# EAGLE design Pixel8x4U (EAGLE 9.6.2)
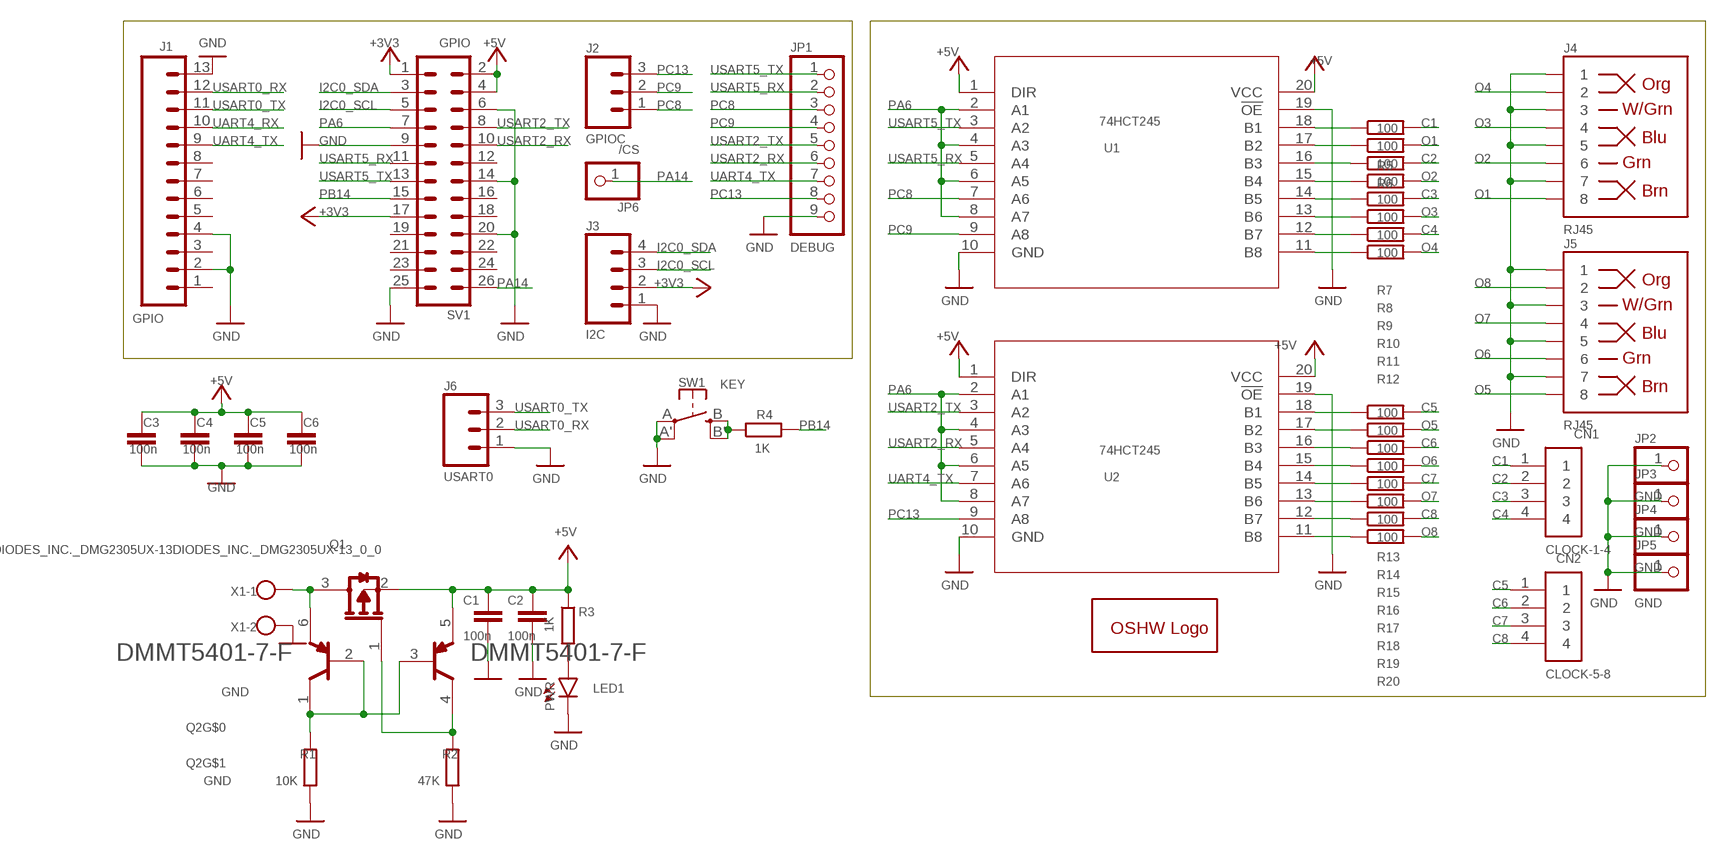
[diagram p0: schematic, sheet 1]

## Parts
C1  100n  C-EUC0603  [C0603]
C2  100n  C-EUC0603  [C0603]
C3  100n  C-EUC0603  [C0603]
C4  100n  C-EUC0603  [C0603]
C5  100n  C-EUC0603  [C0603]
C6  100n  C-EUC0603  [C0603]
CN1  CLOCK-1-4  1X4-CLEANBIG  [1X04-CLEANBIG]
CN2  CLOCK-5-8  1X4-CLEANBIG  [1X04-CLEANBIG]
GOLD_ORB_SM1  OSHWLOGOLOGO5MM  [OSHW_5MM]
J1  GPIO  CONN_13  [1X13]
J2  GPIOC  CONN_03  [1X03]
J3  I2C  CONN_04  [1X04]
J4  RJ45  RJ45-8  [RJ45-8]
J5  RJ45  RJ45-8  [RJ45-8]
J6  USART0  CONN_03  [1X03]
JP1  DEBUG  PINHD-1X9  [1X09]
JP2  GND  PINHD-1X1CB  [1X01-CLEANBIG]
JP3  GND  PINHD-1X1CB  [1X01-CLEANBIG]
JP4  GND  PINHD-1X1CB  [1X01-CLEANBIG]
JP5  GND  PINHD-1X1CB  [1X01-CLEANBIG]
JP6  /CS  PINHD-1X1CB  [1X01-CLEANBIG]
LED1  PWR  LEDCHIP-LED0603  [CHIP-LED0603]
Q1  DIODES_INC._DMG2305UX-13DIODES_INC._DMG2305UX-13_0_0  [DIODES_INC._DMG2305UX-13_0]
Q2  DMMT5401-7-F_0_0  DIODES_DMMT5401-7-FDIODES_DMMT5401-7-F_0_0  [DIODES_DMMT5401-7-F_0]
R1  10K  R-EU_R0402  [R0402]
R2  47K  R-EU_R0402  [R0402]
R3  1K  R-EU_R0402  [R0402]
R4  1K  R-EU_R0402  [R0402]
R5  100  R-EU_R0402  [R0402]
R6  100  R-EU_R0402  [R0402]
R7  100  R-EU_R0402  [R0402]
R8  100  R-EU_R0402  [R0402]
R9  100  R-EU_R0402  [R0402]
R10  100  R-EU_R0402  [R0402]
R11  100  R-EU_R0402  [R0402]
R12  100  R-EU_R0402  [R0402]
R13  100  R-EU_R0402  [R0402]
R14  100  R-EU_R0402  [R0402]
R15  100  R-EU_R0402  [R0402]
R16  100  R-EU_R0402  [R0402]
R17  100  R-EU_R0402  [R0402]
R18  100  R-EU_R0402  [R0402]
R19  100  R-EU_R0402  [R0402]
R20  100  R-EU_R0402  [R0402]
SV1  GPIO  MA13-2  [MA13-2]
SW1  KEY  SPST_TACT-EVQQ2  [EVQ-Q2]
U1  74HCT245  SN74HCT245PWR  [PW20]
U2  74HCT245  SN74HCT245PWR  [PW20]
X1  W237-102  [W237-102]

## Nets
+3V3: J3.2 SV1.1 SV1.17
+5V: C1.1 C2.1 C3.1 C4.1 C5.1 C6.1 Q1.2(S) Q2.5(E2) R3.1 SV1.2 SV1.4 U1.1(DIR) U1.20(VCC) U2.1(DIR) U2.20(VCC)
C1: CN1.1 R5.2
C2: CN1.2 R7.2
C3: CN1.3 R9.2
C4: CN1.4 R11.2
C5: CN2.1 R13.2
C6: CN2.2 R15.2
C7: CN2.3 R17.2
C8: CN2.4 R19.2
GND: C1.2 C2.2 C3.2 C4.2 C5.2 C6.2 J1.2 J1.4 J1.13 J3.1 J4.1 J4.3 J4.5 J4.7 J5.1 J5.3 J5.5 J5.7 J6.1 JP1.9 JP2.1 JP3.1 JP4.1 JP5.1 LED1.C R1.1 R2.1 SV1.6 SV1.9 SV1.14 SV1.20 SV1.25 SW1.A'(P1) SW1.A(P) U1.10(GND) U1.19(!OE) U2.10(GND) U2.19(!OE) X1.2
I2C0_SCL: J3.3 SV1.5
I2C0_SDA: J3.4 SV1.3
N$1: Q2.1(C1) Q2.2(B1) Q2.3(B2) R1.2
N$2: Q1.3(D) Q2.6(E1) X1.1
N$3: Q1.1(G) Q2.4(C2) R2.2
N$4: R4.1 SW1.B'(S1) SW1.B(S)
N$5: R6.1 U1.17(B2)
N$6: R12.1 U1.11(B8)
N$7: R10.1 U1.13(B6)
N$8: R8.1 U1.15(B4)
N$9: R5.1 U1.18(B1)
N$10: R7.1 U1.16(B3)
N$11: R14.1 U2.17(B2)
N$12: R16.1 U2.15(B4)
N$13: R18.1 U2.13(B6)
N$14: LED1.A R3.2
N$15: R20.1 U2.11(B8)
N$16: R9.1 U1.14(B5)
N$17: R11.1 U1.12(B7)
N$18: R13.1 U2.18(B1)
N$19: R15.1 U2.16(B3)
N$20: R17.1 U2.14(B5)
N$21: R19.1 U2.12(B7)
O1: J4.8 R6.2
O2: J4.6 R8.2
O3: J4.4 R10.2
O4: J4.2 R12.2
O5: J5.8 R14.2
O6: J5.6 R16.2
O7: J5.4 R18.2
O8: J5.2 R20.2
PA6: SV1.7 U1.2(A1) U1.4(A3) U1.6(A5) U1.8(A7) U2.2(A1) U2.4(A3) U2.6(A5) U2.8(A7)
PA14: JP6.1 SV1.26
PB14: R4.2 SV1.15
PC8: J2.1 JP1.3 U1.7(A6)
PC9: J2.2 JP1.4 U1.9(A8)
PC13: J2.3 JP1.8 U2.9(A8)
UART4_RX: J1.10
UART4_TX: J1.9 JP1.7 U2.7(A6)
USART0_RX: J1.12 J6.2
USART0_TX: J1.11 J6.3
USART2_RX: JP1.6 SV1.10 U2.5(A4)
USART2_TX: JP1.5 SV1.8 U2.3(A2)
USART5_RX: JP1.2 SV1.11 U1.5(A4)
USART5_TX: JP1.1 SV1.13 U1.3(A2)
Unconnected: J1.1 J1.3 J1.5 J1.6 J1.7 J1.8 SV1.12 SV1.16 SV1.18 SV1.19 SV1.21 SV1.22 SV1.23 SV1.24

## Library data of the parts
C1-C6 = rcl:C-EU: CAPACITOR, European symbol; SPICEPREFIX: C
CN1 CN2 = adafruit:1X4: 4-pin connector
GOLD_ORB_SM1 = oshw:OSHWLOGO: The OSHW logo for PCB layout
J1 = SparkFun-Connectors:CONN_13: Multi connection point. Often used as Generic Header-pin footprint for 0.1 inch spaced/style header connections On any of the 0.1 inch spaced packages, you can populate with these: Break Away Headers - Straight <https://www.sparkfun.com/products/116> (PRT-00116) Break Away Male Headers - Right Angle <https://www.sparkfun.com/products/553> (PRT-00553) Female Headers <https://www.sparkfun.com/products/115> (PRT-00115) Break Away Headers - Machine Pin <https://www.sparkfun.com/products/117> (PRT-00117) Break Away Female Headers - Swiss Machine Pin <https://www.sparkfun.com/products/743> (PRT-00743) For SCREWTERMINALS and SPRING TERMINALS visit here: Screw Terimnals on SparkFun.com <https://www.sparkfun.com/search/results?term=Screw+Terminals> (5mm/3.5mm/2.54mm spacing) This device is also useful as a general connection point to wire up your design to another part of your project. Our various solder wires solder well into these plated through hole pads. Hook-Up Wire - Assortment (Stranded, 22 AWG) <https://www.sparkfun.com/products/11375> (PRT-11375) Hook-Up Wire - Assortment (Solid Core, 22 AWG) <https://www.sparkfun.com/products/11367> (PRT-11367) View the entire wire category on our website here <https://www.sparkfun.com/categories/141> Special notes: Molex polarized connector foot print use with SKU : PRT-08231 with associated crimp pins and housings. 1MM SMD Version SKU: PRT-10208 NOTES ON THE VARIANTS LOCK and LOCK_LONGPADS... This footprint was designed to help hold the alignment of a through-hole component (i.e. 6-pin header) while soldering it into place. You may notice that each hole has been shifted either up or down by 0.005 of an inch from it's more standard position (which is a perfectly straight line). This slight alteration caused the pins (the squares in the middle) to touch the edges of the holes. Because they are alternating, it causes a "brace" to hold the component in place. 0.005 has proven to be the perfect amount of "off-center" position when using our standard breakaway headers. Although looks a little odd when you look at the bare footprint, once you have a header in there, the alteration is very hard to notice. Also,if you push a header all the way into place, it is covered up entirely on the bottom side.
J2 J6 = SparkFun-Connectors:CONN_03: Multi connection point. Often used as Generic Header-pin footprint for 0.1 inch spaced/style header connections On any of the 0.1 inch spaced packages, you can populate with these: Break Away Headers - Straight <https://www.sparkfun.com/products/116> (PRT-00116) Break Away Male Headers - Right Angle <https://www.sparkfun.com/products/553> (PRT-00553) Female Headers <https://www.sparkfun.com/products/115> (PRT-00115) Break Away Headers - Machine Pin <https://www.sparkfun.com/products/117> (PRT-00117) Break Away Female Headers - Swiss Machine Pin <https://www.sparkfun.com/products/743> (PRT-00743) Stackable Header - 3 Pin (Female, 0.1") <https://www.sparkfun.com/products/13875> (PRT-13875) For SCREWTERMINALS and SPRING TERMINALS visit here: Screw Terimnals on SparkFun.com <https://www.sparkfun.com/search/results?term=Screw+Terminals> (5mm/3.5mm/2.54mm spacing) This device is also useful as a general connection point to wire up your design to another part of your project. Our various solder wires solder well into these plated through hole pads. Hook-Up Wire - Assortment (Stranded, 22 AWG) <https://www.sparkfun.com/products/11375> (PRT-11375) Hook-Up Wire - Assortment (Solid Core, 22 AWG) <https://www.sparkfun.com/products/11367> (PRT-11367) View the entire wire category on our website here <https://www.sparkfun.com/categories/141> Special notes: Molex polarized connector foot print use with SKU : PRT-08232 with associated crimp pins and housings.
J3 = SparkFun-Connectors:CONN_04: Multi connection point. Often used as Generic Header-pin footprint for 0.1 inch spaced/style header connections On any of the 0.1 inch spaced packages, you can populate with these: Break Away Headers - Straight <https://www.sparkfun.com/products/116> (PRT-00116) Break Away Male Headers - Right Angle <https://www.sparkfun.com/products/553> (PRT-00553) Female Headers <https://www.sparkfun.com/products/115> (PRT-00115) Break Away Headers - Machine Pin <https://www.sparkfun.com/products/117> (PRT-00117) Break Away Female Headers - Swiss Machine Pin <https://www.sparkfun.com/products/743> (PRT-00743) For SCREWTERMINALS and SPRING TERMINALS visit here: Screw Terimnals on SparkFun.com <https://www.sparkfun.com/search/results?term=Screw+Terminals> (5mm/3.5mm/2.54mm spacing) This device is also useful as a general connection point to wire up your design to another part of your project. Our various solder wires solder well into these plated through hole pads. Hook-Up Wire - Assortment (Stranded, 22 AWG) <https://www.sparkfun.com/products/11375> (PRT-11375) Hook-Up Wire - Assortment (Solid Core, 22 AWG) <https://www.sparkfun.com/products/11367> (PRT-11367) View the entire wire category on our website here <https://www.sparkfun.com/categories/141> Special notes: Molex polarized connector foot print use with SKU : PRT-08231 with associated crimp pins and housings. 1MM SMD Version SKU: PRT-10208; PROD_ID: CONN-09696
J4 J5 = SparkFun-Connectors:RJ45-8: RJ45 Jack - 8 pin Simple RJ45, 8-pin connection. Commonly used for Cat5, Cat5e, and Cat6 Ethernet cables. Here is the connector we sell at SparkFun: RJ45 8-Pin Connector <https://www.sparkfun.com/products/643> (PRT-00643) Datasheet <https://cdn.sparkfun.com/datasheets/Prototyping/04908.pdf> It is used on this SparkFun product: SparkFun RJ45 Breakout <https://www.sparkfun.com/products/716> (BOB-00716) Note, you may also be interested in the "MAGJACK" version of this. It is basically a RJ45 connector, but also has some status LEDs built into the connector housing. You can check that out in this library at the device named "MAGJACK.dev" and see these products online: RJ45 Ethernet MagJack-Compatible <https://www.sparkfun.com/products/8534> (PRT-08534) SparkFun RJ45 MagJack Breakout <https://www.sparkfun.com/products/13021> (BOB-13021); PROD_ID: CONN-08506; SF_ID: PRT-00643
JP1 = pinhead:PINHD-1X9: PIN HEADER
JP2-JP6 = adafruit:PINHD-1X1: Pin header 1x1 for 0.1" spacing With round pins
LED1 = led:LED: LED OSRAM: - CHIPLED LG R971, LG N971, LY N971, LG Q971, LY Q971, LO R971, LY R971 LH N974, LH R974 LS Q976, LO Q976, LY Q976 LO Q996 - Hyper CHIPLED LW Q18S LB Q993, LB Q99A, LB R99A - SideLED LS A670, LO A670, LY A670, LG A670, LP A670 LB A673, LV A673, LT A673, LW A673 LH A674 LY A675 LS A676, LA A676, LO A676, LY A676, LW A676 LS A679, LY A679, LG A679 - Hyper Micro SIDELED® LS Y876, LA Y876, LO Y876, LY Y876 LT Y87S - SmartLED LW L88C, LW L88S LB L89C, LB L89S, LG L890 LS L89K, LO L89K, LY L89K LS L896, LA L896, LO L896, LY L896 - TOPLED LS T670, LO T670, LY T670, LG T670, LP T670 LSG T670, LSP T670, LSY T670, LOP T670, LYG T670 LG T671, LOG T671, LSG T671 LB T673, LV T673, LT T673, LW T673 LH T674 LS T676, LA T676, LO T676, LY T676, LB T676, LH T676, LSB T676, LW T676 LB T67C, LV T67C, LT T67C, LS T67K, LO T67K, LY T67K, LW E67C LS E67B, LA E67B, LO E67B, LY E67B, LB E67C, LV E67C, LT E67C LW T67C LS T679, LY T679, LG T679 LS T770, LO T770, LY T770, LG T770, LP T770 LB T773, LV T773, LT T773, LW T773 LH T774 LS E675, LA E675, LY E675, LS T675 LS T776, LA T776, LO T776, LY T776, LB T776 LHGB T686 LT T68C, LB T68C - Hyper Mini TOPLED® LB M676 - Mini TOPLED Santana® LG M470 LS M47K, LO M47K, LY M47K Source: http://www.osram.convergy.de LUXEON: - LUMILED® LXK2-PW12-R00, LXK2-PW12-S00, LXK2-PW14-U00, LXK2-PW14-V00 LXK2-PM12-R00, LXK2-PM12-S00, LXK2-PM14-U00 LXK2-PE12-Q00, LXK2-PE12-R00, LXK2-PE12-S00, LXK2-PE14-T00, LXK2-PE14-U00 LXK2-PB12-K00, LXK2-PB12-L00, LXK2-PB12-M00, LXK2-PB14-N00, LXK2-PB14-P00, LXK2-PB14-Q00 LXK2-PR12-L00, LXK2-PR12-M00, LXK2-PR14-Q00, LXK2-PR14-R00 LXK2-PD12-Q00, LXK2-PD12-R00, LXK2-PD12-S00 LXK2-PH12-R00, LXK2-PH12-S00 LXK2-PL12-P00, LXK2-PL12-Q00, LXK2-PL12-R00 Source: www.luxeon.com KINGBRIGHT: KA-3528ASYC Source: www.kingbright.com
Q1 = Diodes Inc. - DMG2305UX-13:DIODES_INC._DMG2305UX-13: P-Channel 20V 4.2A (Ta) 1.4W (Ta) Surface Mount SOT-23; AUTOMOTIVE: No; CENTROID_NOT_SPECIFIED: No; CONTINUOUS_DRAIN_CURRENT: -4.2A; DATASHEET: https://www.diodes.com/assets/Datasheets/DMG2305UX.pdf; DEPLETION_MODE: False; DEVICE_CLASS_L1: Discrete Semiconductors; DEVICE_CLASS_L2: Transistors; DEVICE_CLASS_L3: MOSFETs; DIGIKEY_DESCRIPTION: TRANS MOSFET P-CH 20V 4.2A SOT23; DIGIKEY_PART_NUMBER: DMG2305UX-13DICT-ND; DRAIN_TO_SOURCE_BREAKDOWN_VOLTAGE: -20V; DRAIN_TO_SOURCE_RESISTANCE: 40mΩ; DRAIN_TO_SOURCE_VOLTAGE: -20V; FOOTPRINT_PARAMETERS_1: {"fp_type":"SOT23","params":{"N":{"default":"3","long name":"Number of leads","type":"multichoice","short name":"N"},"A":{"nom":1024999,"long name":"Height","min":903000,"max":1100000,"short name":"A","type":"measurement"},"A1":{"nom":50000,"long name":"Package clearance","min":13000,"max":100000,"short name":"A1","type":"measurement"},"A2":{"nom":975000,"long name":"Package height","min":890000,"max":1000000,"short name":"A2","type":"measurement"},"D":{"nom":2900000,"long name":"Package length","min":2800000,"max":3000000,"short name":"D","type":"measurement"},"E":{"nom":2400000,"long name":"Width /w leads","min":2300000,"max":2500000,"short name":"E","type":"measurement"},"E1":{"nom":1300000,"long name":"Package width","min":1200000,"max":1400000,"short name":"E1","type":"measurement"},"B":{"nom":400000,"long name":"Lead width","min":370000,"max":510000,"short name":"B","type":"measurement"},"C":{"nom":110000,"long name":"Lead thickness","min":85000,"max":150000,"short name":"C","type":"measurement"},"L":{"nom":400000,"long name":"Lead foot length","min":250000,"max":550000,"short name":"L","type":"measurement"},"e":{"nom":915000,"long name":"Lead pitch","min":null,"max":null,"short name":"e","type":"measurement"},"PHI":{"nom":false,"long name":"Lead angle","min":0,"max":8000000,"short name":"PHI","type":"measurement"},"offset x":{"nom":0,"long name":"X Center offset","min":null,"max":null,"short name":"offset x","type":"measurement"},"offset y":{"nom":0,"long name":"Y Center offset","min":null,"max":null,"short name":"offset y","type":"measurement"},"LS":{"default":"Rounded rectangle","long name":"Land shape","type":"multichoice","short name":"LS"},"LS1":{"default":"Rectangle","long name":"Land shape (Pin 1)","type":"multichoice","short name":"LS1"},"solder toe":{"nom":550000,"long name":"Solder fillet (toe)","min":null,"max":null,"short name":"solder toe","type":"fixedmeasurement"},"solder heel":{"nom":450000,"long name":"Solder fillet (heel)","min":null,"max":null,"short name":"solder heel","type":"fixedmeasurement"},"solder side":{"nom":50000,"long name":"Solder fillet (side)","min":null,"max":null,"short name":"solder side","type":"fixedmeasurement"},"courtyard":{"nom":500000,"long name":"Courtyard","min":null,"max":null,"short name":"courtyard","type":"fixedmeasurement"},"SF":{"default":"A","long name":"Packing level","type":"multichoiceparent","short name":"SF","help":"http://support.upverter.com/customer/portal/articles/978783-what-is-a-footprint-packing-level","children":["solder toe","solder heel","solder side","courtyard"]}}}; FOOTPRINT_PARAMETERS_2: {"fp_type":"SOT23","params":{"N":{"default":"3","long name":"Number of leads","type":"multichoice","short name":"N"},"A":{"nom":1024999,"long name":"Height","min":903000,"max":1100000,"short name":"A","type":"measurement"},"A1":{"nom":50000,"long name":"Package clearance","min":13000,"max":100000,"short name":"A1","type":"measurement"},"A2":{"nom":975000,"long name":"Package height","min":890000,"max":1000000,"short name":"A2","type":"measurement"},"D":{"nom":2900000,"long name":"Package length","min":2800000,"max":3000000,"short name":"D","type":"measurement"},"E":{"nom":2400000,"long name":"Width /w leads","min":2300000,"max":2500000,"short name":"E","type":"measurement"},"E1":{"nom":1300000,"long name":"Package width","min":1200000,"max":1400000,"short name":"E1","type":"measurement"},"B":{"nom":400000,"long name":"Lead width","min":370000,"max":510000,"short name":"B","type":"measurement"},"C":{"nom":110000,"long name":"Lead thickness","min":85000,"max":150000,"short name":"C","type":"measurement"},"L":{"nom":400000,"long name":"Lead foot length","min":250000,"max":550000,"short name":"L","type":"measurement"},"e":{"nom":915000,"long name":"Lead pitch","min":null,"max":null,"short name":"e","type":"measurement"},"PHI":{"nom":false,"long name":"Lead angle","min":0,"max":8000000,"short name":"PHI","type":"measurement"},"offset x":{"nom":0,"long name":"X Center offset","min":null,"max":null,"short name":"offset x","type":"measurement"},"offset y":{"nom":0,"long name":"Y Center offset","min":null,"max":null,"short name":"offset y","type":"measurement"},"LS":{"default":"Rounded rectangle","long name":"Land shape","type":"multichoice","short name":"LS"},"LS1":{"default":"Rectangle","long name":"Land shape (Pin 1)","type":"multichoice","short name":"LS1"},"solder toe":{"nom":350000,"long name":"Solder fillet (toe)","min":null,"max":null,"short name":"solder toe","type":"fixedmeasurement"},"solder heel":{"nom":350000,"long name":"Solder fillet (heel)","min":null,"max":null,"short name":"solder heel","type":"fixedmeasurement"},"solder side":{"nom":30000,"long name":"Solder fillet (side)","min":null,"max":null,"short name":"solder side","type":"fixedmeasurement"},"courtyard":{"nom":250000,"long name":"Courtyard","min":null,"max":null,"short name":"courtyard","type":"fixedmeasurement"},"SF":{"default":"B","long name":"Packing level","type":"multichoiceparent","short name":"SF","help":"http://support.upverter.com/customer/portal/articles/978783-what-is-a-footprint-packing-level","children":["solder toe","solder heel","solder side","courtyard"]}}}; FOOTPRINT_PARAMETERS_3: {"fp_type":"SOT23","params":{"N":{"default":"3","long name":"Number of leads","type":"multichoice","short name":"N"},"A":{"nom":1024999,"long name":"Height","min":903000,"max":1100000,"short name":"A","type":"measurement"},"A1":{"nom":50000,"long name":"Package clearance","min":13000,"max":100000,"short name":"A1","type":"measurement"},"A2":{"nom":975000,"long name":"Package height","min":890000,"max":1000000,"short name":"A2","type":"measurement"},"D":{"nom":2900000,"long name":"Package length","min":2800000,"max":3000000,"short name":"D","type":"measurement"},"E":{"nom":2400000,"long name":"Width /w leads","min":2300000,"max":2500000,"short name":"E","type":"measurement"},"E1":{"nom":1300000,"long name":"Package width","min":1200000,"max":1400000,"short name":"E1","type":"measurement"},"B":{"nom":400000,"long name":"Lead width","min":370000,"max":510000,"short name":"B","type":"measurement"},"C":{"nom":110000,"long name":"Lead thickness","min":85000,"max":150000,"short name":"C","type":"measurement"},"L":{"nom":400000,"long name":"Lead foot length","min":250000,"max":550000,"short name":"L","type":"measurement"},"e":{"nom":915000,"long name":"Lead pitch","min":null,"max":null,"short name":"e","type":"measurement"},"PHI":{"nom":false,"long name":"Lead angle","min":0,"max":8000000,"short name":"PHI","type":"measurement"},"offset x":{"nom":0,"long name":"X Center offset","min":null,"max":null,"short name":"offset x","type":"measurement"},"offset y":{"nom":0,"long name":"Y Center offset","min":null,"max":null,"short name":"offset y","type":"measurement"},"LS":{"default":"Rounded rectangle","long name":"Land shape","type":"multichoice","short name":"LS"},"LS1":{"default":"Rectangle","long name":"Land shape (Pin 1)","type":"multichoice","short name":"LS1"},"solder toe":{"nom":150000,"long name":"Solder fillet (toe)","min":null,"max":null,"short name":"solder toe","type":"fixedmeasurement"},"solder heel":{"nom":250000,"long name":"Solder fillet (heel)","min":null,"max":null,"short name":"solder heel","type":"fixedmeasurement"},"solder side":{"nom":10000,"long name":"Solder fillet (side)","min":null,"max":null,"short name":"solder side","type":"fixedmeasurement"},"courtyard":{"nom":100000,"long name":"Courtyard","min":null,"max":null,"short name":"courtyard","type":"fixedmeasurement"},"SF":{"default":"C","long name":"Packing level","type":"multichoiceparent","short name":"SF","help":"http://support.upverter.com/customer/portal/articles/978783-what-is-a-footprint-packing-level","children":["solder toe","solder heel","solder side","courtyard"]}}}; FOOTPRINT_URL: https://www.diodes.com/assets/Package-Files/SOT23.pdf; FOOTPRINT_VARIANT_NAME_0: Recommended_Land_Pattern; FOOTPRINT_VARIANT_NAME_1: IPC_A; FOOTPRINT_VARIANT_NAME_2: IPC_B; FOOTPRINT_VARIANT_NAME_3: IPC_C; GATE_CHARGE_AT_VGS: 10.2nC @ -4.5V; GATE_TO_SOURCE_VOLTAGE: 8V; HEIGHT: 1.1mm; INPUT_CAPACITACE_AT_VDS: 808pF @ -15V; IPC_LAND_PATTERN_NAME: SOT92P240X102-3; LEAD_FREE: Yes; MAX_JUNCTION_TEMP: +150°C; MF: Diodes Inc.; MFG_PACKAGE_IDENT: SOT23; MFG_PACKAGE_IDENT_DATE: 01/2017; MFG_PACKAGE_IDENT_REV: 0; MOUSER_DESCRIPTION: MOSFET P-Ch ENH FET -20V 52mOhm -5.0V; MOUSER_PART_NUMBER: 621-DMG2305UX-13; MPN: DMG2305UX-13; NUMBER_OF_CHANNELS: 1; NUMBER_OF_P_CHANNELS: 1; PACKAGE: SOT23; POWER_DISSIPATION: 1.4W; PREFIX: Q; PULSE_DRAIN_CURRENT: -15A; ROHS: Yes; RTHJA_MAX: 90°C/W; STANDOFF_HEIGHT: 0.013mm; TEMPERATURE_RANGE_HIGH: +150°C; TEMPERATURE_RANGE_LOW: -55°C; THRESHOLD_VGS_MAX: -0.9V; THRESHOLD_VGS_MIN: -0.5V; TURN_OFF_DELAY_TIME: 79.3ns; TURN_ON_DELAY_TIME: 10.8ns; VERIFICATION_VERSION: 0.0.0.3
Q2 = Diodes - DMMT5401-7-F:DIODES_DMMT5401-7-F: Bipolar (BJT) Transistor Array 2 PNP (Dual) Matched Pair 150V 200mA 300MHz 300mW Surface Mount SOT-26; AUTOMOTIVE: Yes; AUTOMOTIVE_GRADE: Grade 0; CENTROID_NOT_SPECIFIED: No; CIIVA_IDS: 854262; COLLECTOR_BASE_VOLTAGE: -160V; COLLECTOR_EMITTER_BREAKDOWN_VOLTAGE: -150V; COLLECTOR_EMITTER_SATURATION_VOLTAGE: -0.5V; COLLECTOR_EMITTER_VOLTAGE: -150V; DATASHEET: https://www.diodes.com/assets/Datasheets/ds30437.pdf; DEVICE_CLASS_L1: Discrete Semiconductors; DEVICE_CLASS_L2: Transistors; DEVICE_CLASS_L3: BJTs; DIGIKEY_DESCRIPTION: TRANS 2PNP 150V 0.2A SOT26; DIGIKEY_PART_NUMBER: DMMT5401-FDICT-ND; EMITTER_BASE_VOLTAGE: -5V; FOOTPRINT_PARAMETERS_1: {"fp_type":"SOT23","params":{"N":{"default":"6","long name":"Number of leads","type":"multichoice","short name":"N"},"A":{"nom":1150000,"long name":"Height","min":1012999,"max":1400000,"short name":"A","type":"measurement"},"A1":{"nom":50000,"long name":"Package clearance","min":13000,"max":100000,"short name":"A1","type":"measurement"},"A2":{"nom":1100000,"long name":"Package height","min":1000000,"max":1300000,"short name":"A2","type":"measurement"},"D":{"nom":3000000,"long name":"Package length","min":2900000,"max":3100000,"short name":"D","type":"measurement"},"E":{"nom":2800000,"long name":"Width /w leads","min":2700000,"max":3000000,"short name":"E","type":"measurement"},"E1":{"nom":1600000,"long name":"Package width","min":1500000,"max":1700000,"short name":"E1","type":"measurement"},"B":{"nom":380000,"long name":"Lead width","min":350000,"max":500000,"short name":"B","type":"measurement"},"C":{"nom":150000,"long name":"Lead thickness","min":100000,"max":200000,"short name":"C","type":"measurement"},"L":{"nom":400000,"long name":"Lead foot length","min":350000,"max":550000,"short name":"L","type":"measurement"},"e":{"nom":950000,"long name":"Lead pitch","min":null,"max":null,"short name":"e","type":"measurement"},"PHI":{"nom":false,"long name":"Lead angle","min":0,"max":8000000,"short name":"PHI","type":"measurement"},"offset x":{"nom":0,"long name":"X Center offset","min":null,"max":null,"short name":"offset x","type":"measurement"},"offset y":{"nom":0,"long name":"Y Center offset","min":null,"max":null,"short name":"offset y","type":"measurement"},"LS":{"default":"Rounded rectangle","long name":"Land shape","type":"multichoice","short name":"LS"},"LS1":{"default":"Rectangle","long name":"Land shape (Pin 1)","type":"multichoice","short name":"LS1"},"solder toe":{"nom":550000,"long name":"Solder fillet (toe)","min":null,"max":null,"short name":"solder toe","type":"fixedmeasurement"},"solder heel":{"nom":450000,"long name":"Solder fillet (heel)","min":null,"max":null,"short name":"solder heel","type":"fixedmeasurement"},"solder side":{"nom":50000,"long name":"Solder fillet (side)","min":null,"max":null,"short name":"solder side","type":"fixedmeasurement"},"courtyard":{"nom":500000,"long name":"Courtyard","min":null,"max":null,"short name":"courtyard","type":"fixedmeasurement"},"SF":{"default":"A","long name":"Packing level","type":"multichoiceparent","short name":"SF","help":"http://support.upverter.com/customer/portal/articles/978783-what-is-a-footprint-packing-level","children":["solder toe","solder heel","solder side","courtyard"]}}}; FOOTPRINT_PARAMETERS_2: {"fp_type":"SOT23","params":{"N":{"default":"6","long name":"Number of leads","type":"multichoice","short name":"N"},"A":{"nom":1150000,"long name":"Height","min":1012999,"max":1400000,"short name":"A","type":"measurement"},"A1":{"nom":50000,"long name":"Package clearance","min":13000,"max":100000,"short name":"A1","type":"measurement"},"A2":{"nom":1100000,"long name":"Package height","min":1000000,"max":1300000,"short name":"A2","type":"measurement"},"D":{"nom":3000000,"long name":"Package length","min":2900000,"max":3100000,"short name":"D","type":"measurement"},"E":{"nom":2800000,"long name":"Width /w leads","min":2700000,"max":3000000,"short name":"E","type":"measurement"},"E1":{"nom":1600000,"long name":"Package width","min":1500000,"max":1700000,"short name":"E1","type":"measurement"},"B":{"nom":380000,"long name":"Lead width","min":350000,"max":500000,"short name":"B","type":"measurement"},"C":{"nom":150000,"long name":"Lead thickness","min":100000,"max":200000,"short name":"C","type":"measurement"},"L":{"nom":400000,"long name":"Lead foot length","min":350000,"max":550000,"short name":"L","type":"measurement"},"e":{"nom":950000,"long name":"Lead pitch","min":null,"max":null,"short name":"e","type":"measurement"},"PHI":{"nom":false,"long name":"Lead angle","min":0,"max":8000000,"short name":"PHI","type":"measurement"},"offset x":{"nom":0,"long name":"X Center offset","min":null,"max":null,"short name":"offset x","type":"measurement"},"offset y":{"nom":0,"long name":"Y Center offset","min":null,"max":null,"short name":"offset y","type":"measurement"},"LS":{"default":"Rounded rectangle","long name":"Land shape","type":"multichoice","short name":"LS"},"LS1":{"default":"Rectangle","long name":"Land shape (Pin 1)","type":"multichoice","short name":"LS1"},"solder toe":{"nom":350000,"long name":"Solder fillet (toe)","min":null,"max":null,"short name":"solder toe","type":"fixedmeasurement"},"solder heel":{"nom":350000,"long name":"Solder fillet (heel)","min":null,"max":null,"short name":"solder heel","type":"fixedmeasurement"},"solder side":{"nom":30000,"long name":"Solder fillet (side)","min":null,"max":null,"short name":"solder side","type":"fixedmeasurement"},"courtyard":{"nom":250000,"long name":"Courtyard","min":null,"max":null,"short name":"courtyard","type":"fixedmeasurement"},"SF":{"default":"B","long name":"Packing level","type":"multichoiceparent","short name":"SF","help":"http://support.upverter.com/customer/portal/articles/978783-what-is-a-footprint-packing-level","children":["solder toe","solder heel","solder side","courtyard"]}}}; FOOTPRINT_PARAMETERS_3: {"fp_type":"SOT23","params":{"N":{"default":"6","long name":"Number of leads","type":"multichoice","short name":"N"},"A":{"nom":1150000,"long name":"Height","min":1012999,"max":1400000,"short name":"A","type":"measurement"},"A1":{"nom":50000,"long name":"Package clearance","min":13000,"max":100000,"short name":"A1","type":"measurement"},"A2":{"nom":1100000,"long name":"Package height","min":1000000,"max":1300000,"short name":"A2","type":"measurement"},"D":{"nom":3000000,"long name":"Package length","min":2900000,"max":3100000,"short name":"D","type":"measurement"},"E":{"nom":2800000,"long name":"Width /w leads","min":2700000,"max":3000000,"short name":"E","type":"measurement"},"E1":{"nom":1600000,"long name":"Package width","min":1500000,"max":1700000,"short name":"E1","type":"measurement"},"B":{"nom":380000,"long name":"Lead width","min":350000,"max":500000,"short name":"B","type":"measurement"},"C":{"nom":150000,"long name":"Lead thickness","min":100000,"max":200000,"short name":"C","type":"measurement"},"L":{"nom":400000,"long name":"Lead foot length","min":350000,"max":550000,"short name":"L","type":"measurement"},"e":{"nom":950000,"long name":"Lead pitch","min":null,"max":null,"short name":"e","type":"measurement"},"PHI":{"nom":false,"long name":"Lead angle","min":0,"max":8000000,"short name":"PHI","type":"measurement"},"offset x":{"nom":0,"long name":"X Center offset","min":null,"max":null,"short name":"offset x","type":"measurement"},"offset y":{"nom":0,"long name":"Y Center offset","min":null,"max":null,"short name":"offset y","type":"measurement"},"LS":{"default":"Rounded rectangle","long name":"Land shape","type":"multichoice","short name":"LS"},"LS1":{"default":"Rectangle","long name":"Land shape (Pin 1)","type":"multichoice","short name":"LS1"},"solder toe":{"nom":150000,"long name":"Solder fillet (toe)","min":null,"max":null,"short name":"solder toe","type":"fixedmeasurement"},"solder heel":{"nom":250000,"long name":"Solder fillet (heel)","min":null,"max":null,"short name":"solder heel","type":"fixedmeasurement"},"solder side":{"nom":10000,"long name":"Solder fillet (side)","min":null,"max":null,"short name":"solder side","type":"fixedmeasurement"},"courtyard":{"nom":100000,"long name":"Courtyard","min":null,"max":null,"short name":"courtyard","type":"fixedmeasurement"},"SF":{"default":"C","long name":"Packing level","type":"multichoiceparent","short name":"SF","help":"http://support.upverter.com/customer/portal/articles/978783-what-is-a-footprint-packing-level","children":["solder toe","solder heel","solder side","courtyard"]}}}; FOOTPRINT_URL: https://www.diodes.com/assets/Package-Files/SOT26-SC74R.pdf; FOOTPRINT_VARIANT_NAME_0: Recommended_Land_Pattern; FOOTPRINT_VARIANT_NAME_1: IPC_A; FOOTPRINT_VARIANT_NAME_2: IPC_B; FOOTPRINT_VARIANT_NAME_3: IPC_C; GAIN_BANDWIDTH_PRODUCT: 100MHz; HEIGHT: 1.4mm; HFE_MAX: 240; HFE_MIN: 60; HFE_SS_MAX: 260; HFE_SS_MIN: 40; HFE_SS_TESTIC: -1mA; HFE_SS_TESTVCE: -10V; HFE_TESTIC: -10mA; HFE_TESTVCE: -5V; IMPORTED_FROM: vault; IMPORT_TS: 1521857859; LEAD_FREE: Yes; MAX_COLLECTOR_CURRENT: -200mA; MAX_JUNCTION_TEMP: +150°C; MF: Diodes; MFG_PACKAGE_IDENT: SOT26 (SC74R); MFG_PACKAGE_IDENT_COMPONENT_ID: 5f0f242ef940d63b; MFG_PACKAGE_IDENT_DATE: 03/2017; MFG_PACKAGE_IDENT_REV: 0; MOUSER_DESCRIPTION: Bipolar Transistors - BJT MATCHED PNP SM SIGNAL TRANS; MOUSER_PART_NUMBER: 621-DMMT5401-7-F; MPN: DMMT5401-7-F; NUMBER_OF_ELEMENTS: 2; NUMBER_OF_PNP: 2; PACKAGE: SOT-26-6; POWER_DISSIPATION: 300mW; PREFIX: Q; RELEASE_DATE: 1475030218; RESISTANCE: 56.2 kohm; ROHS: Yes; RTHJA_MAX: 417°C/W; STANDOFF_HEIGHT: 0.013mm; TEMPERATURE_RANGE_HIGH: +150°C; TEMPERATURE_RANGE_LOW: -55°C; VAULT_GUID: AAD9F767-3884-4A64-86E0-FF641185CA98; VERIFICATION_VERSION: 0.0.0.3
R1 R2 R5-R20 = rcl:R-EU_: RESISTOR, European symbol; SPICEPREFIX: R
R3 R4 = resistor:R-EU_: RESISTOR, European symbol
SV1 = con-lstb:MA13-2: PIN HEADER; OC_FARNELL: unknown; OC_NEWARK: unknown
SW1 = adafruit:SPST_TACT: SMT 6mm switch, EVQQ2 series http://www.ladyada.net/library/eagle
U1 U2 = SN74HCT245PWR:SN74HCT245PWR; DATASHEET_URL: http://www.ti.com/lit/gpn/SN74HCT245; DESCRIPTION: Octal Bus Transceivers With 3-State Outputs; FAMILY_NAME: STANDARD TRANSCEIVER; GENERIC_PART_NUMBER: SN74HCT245; INDUSTRY_STD_PKG_TYPE: TSSOP; MANUFACTURER: Texas Instruments; MANUFACTURER_PART_NUMBER: SN74HCT245PWR; PACKAGE_DESIGNATOR: PW; PIN_COUNT: 20; VENDOR: Texas Instruments
X1 = con-wago-500:W237-102: WAGO SCREW CLAMP; MPN: 237-102; OC_FARNELL: unknown; OC_NEWARK: 70K9898

## Board
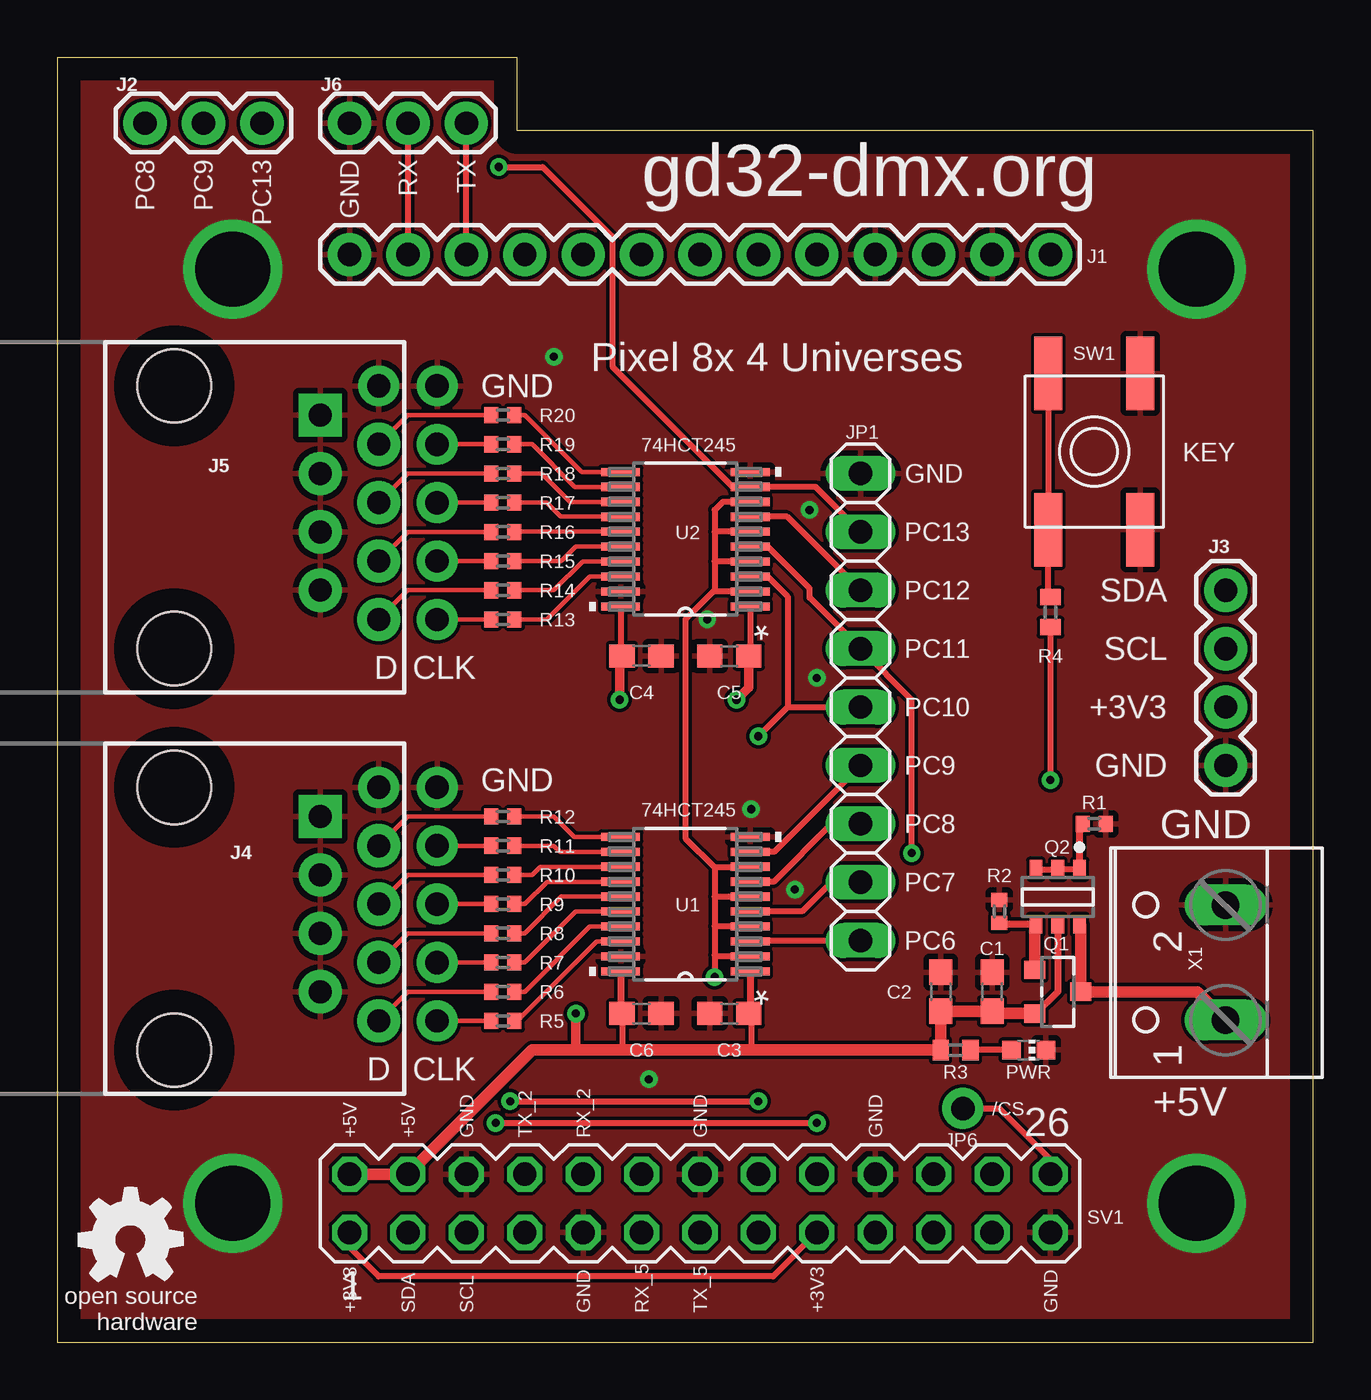
[diagram p1: board, top side]
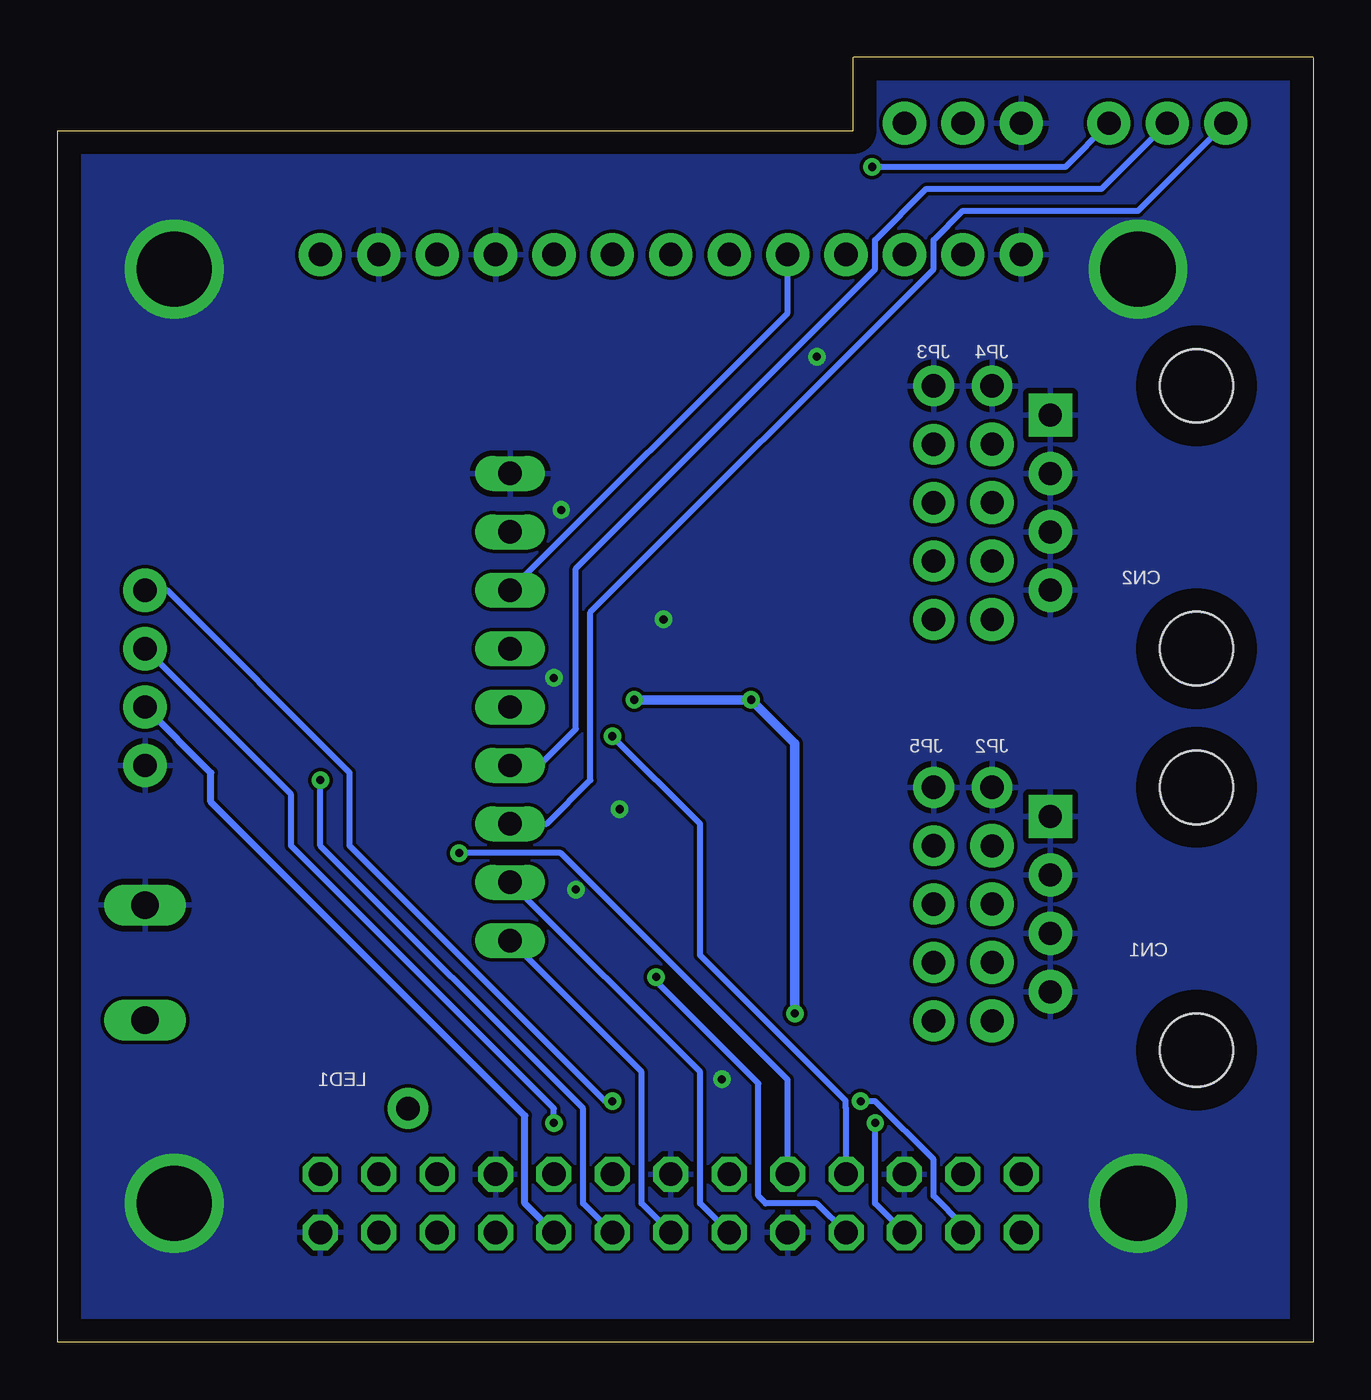
[diagram p2: board, bottom side, seen from below]

Size 54.61 x 55.88 mm. Coordinates in mm from the lower left corner, seen from the top.
Outline: 54.6,52.7 54.6,0 0,0 0,55.87
Outline: 54.61,52.7 20,52.7 20,55.88
Outline: 0,55.88 19.99,55.88
Copper layers (1*16): Top 0.035mm / dielectric 1.5mm / Bottom 0.035mm
Design rules "default": minimum track width 6mil, minimum drill 0.35mm, track to track 6mil, track to pad 6mil, pad to pad 6mil, via to via 6mil, smd to smd 6mil, copper to edge 40mil, drill to drill 6mil, minimum pad ring 10mil, minimum via ring 8mil, stop-mask expansion 4mil, vias tented up to drill 0mil, thermal gap 10mil

### Footprints (pad centres in the part's own frame; a part is rotated, then mirrored left to right if it is on the bottom)
C0603 = smd 1.1 x 1: 1 -0.85,0; 2 0.85,0
1X04-CLEANBIG = drill 1.016 pad 1.778: 1 -3.81,0; 2 -1.27,0; 3 1.27,0; 4 3.81,0
1X13 = drill 1.016 pad 1.88: 1 0,0; 2 2.54,0; 3 5.08,0; 4 7.62,0; 5 10.16,0; 6 12.7,0; 7 15.24,0; 8 17.78,0; 9 20.32,0; 10 22.86,0; 11 25.4,0; 12 27.94,0; 13 30.48,0
1X03 = drill 1.016 pad 1.88: 1 0,0; 2 2.54,0; 3 5.08,0
1X04 = drill 1.016 pad 1.88: 1 0,0; 2 2.54,0; 3 5.08,0; 4 7.62,0
RJ45-8 = drill 1 pad 1.88 square: 1 -4.445,6.35 | drill 1 pad 1.88: 2 -3.175,8.89; 3 -1.905,6.35; 4 -0.635,8.89; 5 0.635,6.35; 6 1.905,8.89; 7 3.175,6.35; 8 4.445,8.89 | hole 3.2: -5.715,0; 5.715,0
1X09 = drill 1.016 long: 1 -10.16,0; 2 -7.62,0; 3 -5.08,0; 4 -2.54,0; 5 0,0; 6 2.54,0; 7 5.08,0; 8 7.62,0; 9 10.16,0
1X01-CLEANBIG = drill 1.016 pad 1.778: 1 0,0
CHIP-LED0603 = smd 0.8 x 0.8: A 0,-0.75; C 0,0.75
DIODES_INC._DMG2305UX-13_0 = smd 0.9 x 0.8: 1 -1,0.95; 2 -1,-0.95; 3 1,0
DIODES_DMMT5401-7-F_0 = smd 0.8 x 0.55: 1 -1.2,0.95; 2 -1.2,0; 3 -1.2,-0.95; 4 1.2,-0.95; 5 1.2,0; 6 1.2,0.95
R0402 = smd 0.6 x 0.7: 1 -0.5,0; 2 0.5,0
R0402' = smd 0.7 x 0.9: 1 -0.65,0; 2 0.65,0
MA13-2 = drill 1.016 octagon: 1 -15.24,-1.27; 2 -15.24,1.27; 3 -12.7,-1.27; 4 -12.7,1.27; 5 -10.16,-1.27; 6 -10.16,1.27; 7 -7.62,-1.27; 8 -7.62,1.27; 9 -5.08,-1.27; 10 -5.08,1.27; 11 -2.54,-1.27; 12 -2.54,1.27; 13 0,-1.27; 14 0,1.27; 15 2.54,-1.27; 16 2.54,1.27; 17 5.08,-1.27; 18 5.08,1.27; 19 7.62,-1.27; 20 7.62,1.27; 21 10.16,-1.27; 22 10.16,1.27; 23 12.7,-1.27; 24 12.7,1.27; 25 15.24,-1.27; 26 15.24,1.27
EVQ-Q2 = smd 3.2 x 1.2: A -3.4,-2; A' 3.4,-2; B -3.4,2; B' 3.4,2
PW20 = smd 1.676 x 0.356: 1 -2.819,2.925; 2 -2.819,2.275; 3 -2.819,1.625; 4 -2.819,0.975; 5 -2.819,0.325; 6 -2.819,-0.325; 7 -2.819,-0.975; 8 -2.819,-1.625; 9 -2.819,-2.275; 10 -2.819,-2.925; 11 2.819,-2.925; 12 2.819,-2.275; 13 2.819,-1.625; 14 2.819,-0.975; 15 2.819,-0.325; 16 2.819,0.325; 17 2.819,0.975; 18 2.819,1.625; 19 2.819,2.275; 20 2.819,2.925
W237-102 = drill 1.194 long: 1 -2.5,-1.27; 2 2.5,-1.27

### Placement (x,y rotation side)
C1  40.64,15.24 90 top
C2  38.42,15.24 90 top
C3  29.21,14.29 180 top
C4  25.4,29.84 0 top
C5  29.21,29.84 180 top
C6  25.4,14.29 0 top
CN1  16.51,17.78 90 top
CN2  16.51,35.24 90 top
GOLD_ORB_SM1  3.18,4.45 0 top
J1  43.18,47.31 180 top
J2  3.81,53.02 0 top
J3  50.8,25.08 90 top
J4  5.08,18.41 270 top
J5  5.08,35.88 270 top
J6  12.7,53.02 0 top
JP1  34.92,27.62 90 top
JP2  13.97,24.13 0 top
JP3  16.51,41.59 0 top
JP4  13.97,41.59 0 top
JP5  16.51,24.13 0 top
JP6  39.37,10.16 0 top
LED1  42.23,12.7 270 top
Q1  43.5,15.24 0 top
Q2  43.5,19.37 270 top
R1  45.09,22.54 180 top
R2  40.96,18.73 270 top
R3  1K  [R0402']  39.05,12.7 0 top
R4  1K  [R0402']  43.18,31.75 270 top
R5  19.37,13.97 180 top
R6  19.37,15.24 180 top
R7  19.37,16.51 180 top
R8  19.37,17.78 180 top
R9  19.37,19.05 180 top
R10  19.37,20.32 180 top
R11  19.37,21.59 180 top
R12  19.37,22.86 180 top
R13  19.37,31.43 180 top
R14  19.37,32.7 180 top
R15  19.37,33.97 180 top
R16  19.37,35.24 180 top
R17  19.37,36.51 180 top
R18  19.37,37.78 180 top
R19  19.37,39.05 180 top
R20  19.37,40.32 180 top
SV1  27.94,6.03 0 top
SW1  45.09,38.73 90 top
U1  27.3,19.05 180 top
U2  27.3,34.92 180 top
X1  49.53,16.51 90 top

### Tracks (layer width: path | path; a pad name or v marks a point on that pad's centre or on a via)
+3V3
  Top 0.254: SV1.17 31.11,2.86 13.97,2.86 12.7,4.13 SV1.1
  Bottom 0.305: SV1.17 34.29,6.03 34.29,9.84 47.94,23.5 47.94,24.77 J3.2
+5V  (via drill 0.35)
  Top 0.254: 40.74,14.29 C1.1 | 42.55,14.29 Q1.2 | U2.1 30.12,29.91 C5.1 | 24.45,29.74 C4.1 24.49,29.91 U2.20 | 30.16,14.19 30.16,12.7 | C6.1 24.55,12.8 24.45,12.7
  Top 0.305: 42.55,14.29 43.5,15.24 Q2.5 | U1.20 24.49,14.35 C6.1 | U1.1 30.12,14.35 C3.1 30.16,14.19
  Top 0.406: C5.1 30.06,28.47 v29.53,27.94 | v24.45,27.94 24.45,29.74 | R3.1 38.42,12.71 | v22.54,14.29 22.54,12.7
  Top 0.508: SV1.2 SV1.4 20.64,12.7 22.54,12.7 24.45,12.7 30.16,12.7 R3.1 | Q1.2 40.74,14.29 | C1.1 C2.1 38.42,12.71
  Bottom 0.406: v29.53,27.94 v24.45,27.94 22.54,26.04 v22.54,14.29
C1
  Top 0.203: CN1.1 R5.2
C2
  Top 0.203: CN1.2 R7.2
C3
  Top 0.203: CN1.3 R9.2
C4
  Top 0.203: CN1.4 R11.2
C5
  Top 0.203: CN2.1 R13.2
C6
  Top 0.203: CN2.2 R15.2
C7
  Top 0.203: CN2.3 R17.2
C8
  Top 0.203: CN2.4 R19.2
GND  (via drill 0.35, 3.28)
  other vias: 7.62,6.03 49.53,6.03 7.62,46.67 49.53,46.67 33.02,28.89 32.7,36.2 21.59,42.86 30.16,23.18 28.26,31.43 32.07,19.68 25.72,11.43
  pour Top: -1.27,57.15 -1.27,-1.27 55.88,-1.27 55.88,57.15
  pour Bottom: -1.27,57.15 -1.27,-1.27 55.88,-1.27 55.88,57.15
I2C0_SCL  (via drill 0.35)
  Top 0.254: v19.05,9.53 v33.02,9.53
  Bottom 0.254: v33.02,9.53 33.02,10.16 44.45,21.59 44.45,23.81 J3.3 | SV1.5 19.05,6.03 v19.05,9.53
I2C0_SDA  (via drill 0.35)
  Top 0.254: v19.69,10.48 v30.48,10.48
  Bottom 0.254: J3.4 49.85,32.7 41.91,24.77 41.91,21.59 30.8,10.48 v30.48,10.48 | SV1.3 15.24,5.08 16.51,6.35 16.51,7.94 19.05,10.48 v19.69,10.48
N$1
  Top 0.254: Q2.1 Q2.2 Q2.3
  Top 0.305: Q2.1 44.45,22.41 R1.2
N$2
  Top 0.254: Q2.6 44.5,18.12
  Top 0.508: 44.5,18.12 Q1.3 49.57,15.24 X1.1
N$3
  Top 0.305: R2.2 41.02,18.17 Q2.4 42.5,18.12
  Top 0.508: 42.5,18.12 Q1.1
N$4
  Top 0.152: R4.1 43.09,32.49
  Top 0.254: SW1.B' SW1.B 43.09,32.49
N$5
  Top 0.203: R6.1 20.32,15.24 23.16,18.07 U1.17
N$6
  Top 0.203: U1.11 22.48,21.98 21.59,22.86 R12.1
N$7
  Top 0.203: R10.1 20.64,20.32 20.99,20.68 U1.13
N$8
  Top 0.203: U1.15 21.92,19.38 20.32,17.78 R8.1
N$9
  Top 0.203: R5.1 20,13.97 23.46,17.43 U1.18
N$10
  Top 0.203: R7.1 20.32,16.51 22.54,18.73 U1.16
N$11
  Top 0.203: R14.1 21.59,32.7 22.84,33.95 U2.17
N$12
  Top 0.152: R16.1
  Top 0.203: R16.1 U2.15
N$13
  Top 0.203: R18.1 21.07,37.78 22.3,36.55 U2.13
N$14
  Top 0.254: LED1.A R3.2
N$15
  Top 0.203: R20.1 20.32,40.32 22.79,37.85 U2.11
N$16
  Top 0.203: U1.14 21.3,20.02 20.32,19.05 R9.1
N$17
  Top 0.203: R11.1 21.59,21.59 21.86,21.32 U1.12
N$18
  Top 0.203: R13.1 21.27,31.43 23.14,33.3 U2.18
N$19
  Top 0.203: R15.1 21.91,33.97 22.54,34.6 U2.16
N$20
  Top 0.203: R17.1 21.27,36.51 21.89,35.9 U2.14
N$21
  Top 0.203: R19.1 20.64,39.05 22.49,37.2 U2.12
O1
  Top 0.203: J4.8 15.24,15.24 R6.2
O2
  Top 0.203: J4.6 15.24,17.78 R8.2
O3
  Top 0.203: J4.4 15.24,20.32 R10.2
O4
  Top 0.203: J4.2 15.24,22.86 R12.2
O5
  Top 0.203: J5.8 15.24,32.7 R14.2
O6
  Top 0.203: J5.6 15.24,35.24 R16.2
O7
  Top 0.203: J5.4 15.24,37.78 R18.2
O8
  Top 0.203: J5.2 15.24,40.32 R20.2
PA6  (via drill 0.35)
  Top 0.254: U2.8 28.93,36.55 28.57,36.2 28.57,35.24 | 28.57,35.24 28.57,33.97 | 28.57,33.97 28.57,32.7 | U2.2 28.63,32.65 28.57,32.7 | U2.4 28.6,33.95 28.57,33.97 | U2.6 28.58,35.25 28.57,35.24 | U1.8 30.09,20.64 28.57,20.64 | 28.57,20.64 28.57,19.37 | 28.57,19.37 28.57,18.1 | 28.57,18.1 28.57,16.83 | 28.57,16.83 v28.57,15.88 | U1.2 28.63,16.77 28.57,16.83 | U1.4 28.6,18.07 28.57,18.1 | U1.6 28.57,19.37 | 28.57,32.7 27.3,31.43 27.3,21.91 28.57,20.64
  Bottom 0.254: SV1.7 21.59,6.03 23.81,6.03 24.13,6.35 24.13,11.24 28.57,15.69 v28.57,15.88
PA14
  Top 0.254: JP6.1 40.96,10.16 43.18,7.94 SV1.26
PB14  (via drill 0.35)
  Top 0.254: R4.2 v43.18,24.45
  Bottom 0.254: SV1.15 31.75,6.03 31.75,10.16 43.18,21.59 v43.18,24.45
PC8
  Top 0.254: U1.7 31.14,20.02 33.66,22.54 JP1.3
  Bottom 0.254: JP1.3 33.34,22.54 31.43,24.45 31.43,31.75 16.51,46.67 16.51,47.94 15.24,49.21 7.62,49.21 J2.1
PC9
  Top 0.254: U1.9 31.17,21.32 JP1.4
  Bottom 0.254: JP1.4 33.66,25.08 32.07,26.67 32.07,33.66 19.05,46.67 19.05,47.94 16.83,50.16 9.21,50.16 J2.2
PC13  (via drill 0.35)
  Top 0.254: JP1.8 32.97,37.2 U2.9 29.36,37.2 24.13,42.43 24.13,48.08 21.09,51.12 v19.19,51.12
  Bottom 0.254: J2.3 10.79,51.12 v19.19,51.12
UART4_TX
  Top 0.254: JP1.7 31.73,35.9 U2.7
  Bottom 0.254: JP1.7 22.86,44.77 J1.9
USART0_RX
  Top 0.254: J6.2 J1.12
USART0_TX
  Top 0.254: J1.11 J6.3
USART2_RX  (via drill 0.35)
  Top 0.152: 30.17,34.65 U2.5
  Top 0.254: 30.17,34.65 30.84,34.65 32.7,32.78 32.7,32.38 JP1.6 37.15,27.94 v37.15,21.27
  Bottom 0.254: SV1.10 22.86,11.41 32.72,21.27 v37.15,21.27
USART2_TX  (via drill 0.35)
  Top 0.254: 31.75,27.62 JP1.5 | 31.75,27.62 v30.48,26.35 | U2.3 30.89,33.3 31.75,32.44 31.75,27.62
  Bottom 0.254: SV1.8 20.32,10.18 20.34,10.21 20.34,10.5 26.67,16.83 26.67,22.54 v30.48,26.35
USART5_RX
  Top 0.254: U1.5 30.13,18.73 32.38,18.73 33.66,20 JP1.2
  Bottom 0.254: SV1.11 26.67,6.03 26.67,11.75 JP1.2
USART5_TX
  Top 0.254: U1.3 30.16,17.46 JP1.1
  Bottom 0.254: SV1.13 29.21,6.03 29.21,11.75 JP1.1

### Text on the board
tNames: PC8 | PC9 | PC13 | GND | RX | TX | gd32-dmx.org | GND | Pixel 8x 4 Universes | GND | PC13 | PC12 | SDA | D | CLK | PC11 | SCL | PC10 | +3V3 | PC9 | GND | GND | PC8 | GND | PC7 | PC6 | D | CLK | +5V | +5V | +5V | GND | TX_2 | RX_2 | GND | GND | +3V3 | SDA | SCL | GND | RX_5 | TX_5 | +3V3 | GND